# Altium schematic sheet USB_Block.SchDoc
size A4; CheckedBy: CT-Energys; Author: CT-Energys; CompanyName: HTD COMPANY LIMITED; DrawnBy: CHITOAN; Engineer: CHITOAN; Organization: Altium Limited; Address1: HO CHI MINH CITY; Address2: VIETNAM
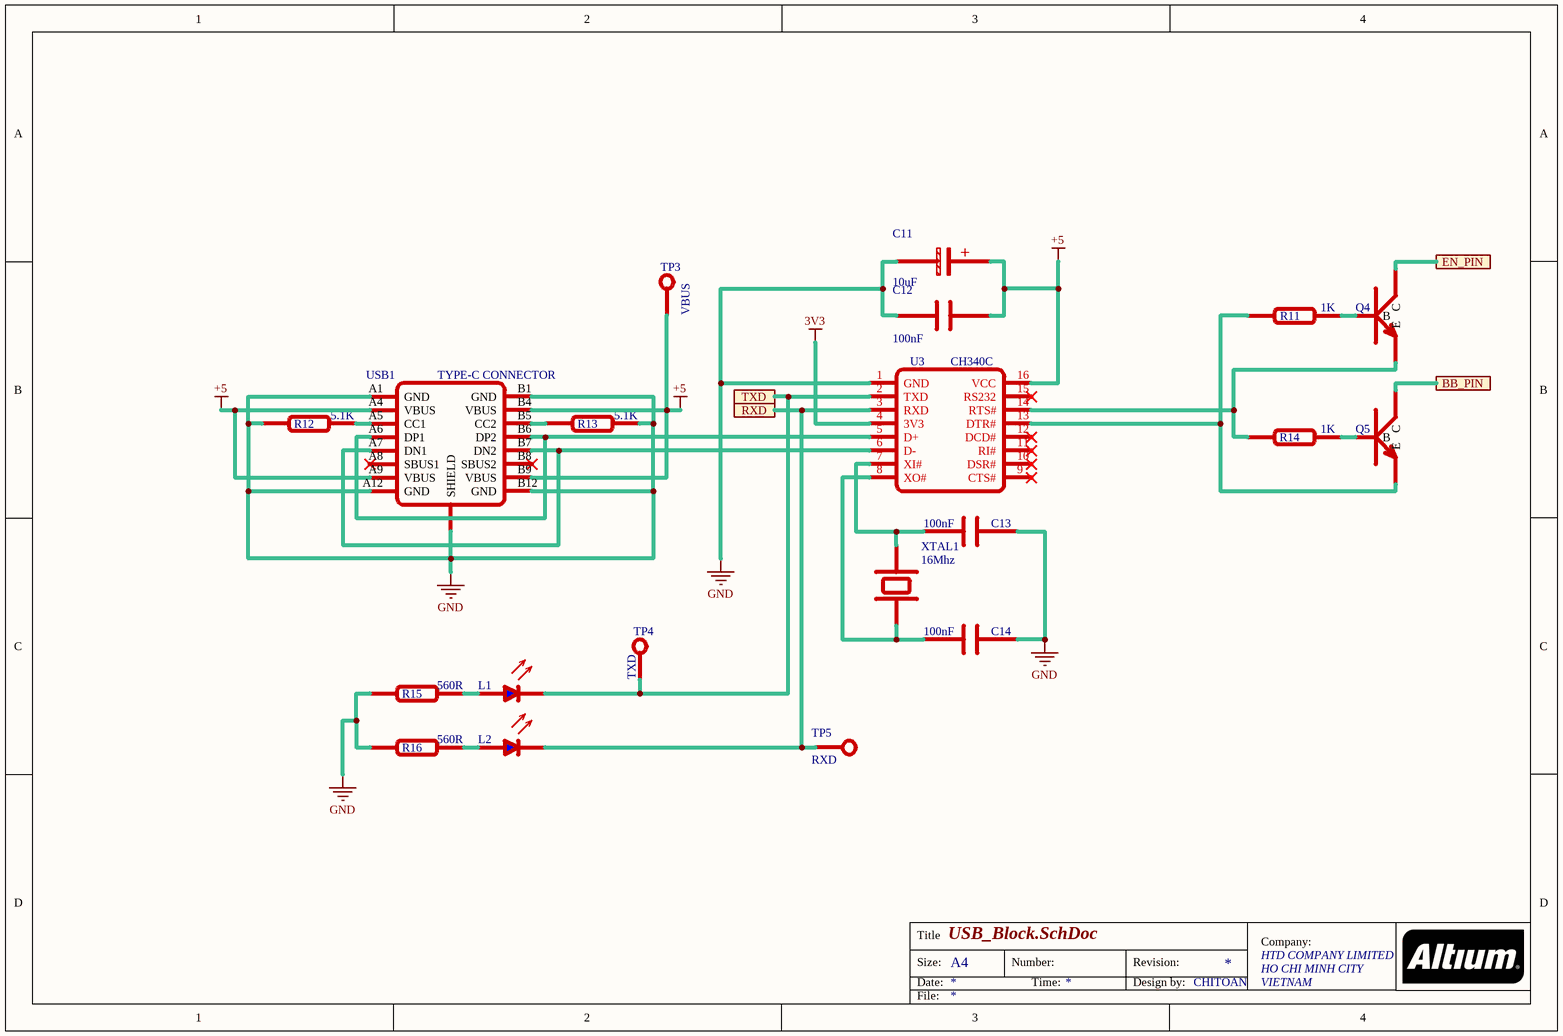
[diagram p0: USB_Block.SchDoc]

## Parts
C11  10uF  [CAP-AL-4x5.4]
C12  100nF  [C0805]
C13  100nF  [C0805]
C14  100nF  [C0805]
L1  LED-BLUE  [LED-0603-BLUE]  (value not drawn)
L2  LED-BLUE  [LED-0603-BLUE]  (value not drawn)
Q4  S8050  [SOT-23]  (value not drawn)
Q5  S8050  [SOT-23]  (value not drawn)
R11  1K  [R0603]
R12  5.1K  [R0603]
R13  5.1K  [R0603]
R14  1K  [R0603]
R15  560R  [R0603]
R16  560R  [R0603]
TP3  VBUS  [Test Point]
TP4  TXD  [Test Point]
TP5  RXD  [Test Point]
U3  CH340C  [SOP-16]
USB1  TYPE-C CONNECTOR  [USB-C-H-K-16P]
XTAL1  16Mhz  [Crystal 5032]

## Ports
BB_PIN, EN_PIN, RXD, TXD

## Nets
3V3: U3.4(3V3)
+5: C11.1 C12.2 TP3.1 U3.16(VCC) USB1.A4(VBUS) USB1.A9(VBUS) USB1.B4(VBUS) USB1.B9(VBUS)
GND: C11.2 C12.1 C13.1 C14.1 R12.2 R13.1 R15.1 R16.1 U3.1(GND) USB1.0(SHIELD) USB1.A1(GND) USB1.A12(GND) USB1.B1(GND) USB1.B12(GND)
BB_PIN: Q5.3(C) ; port BB_PIN
EN_PIN: Q4.3(C) ; port EN_PIN
RXD: L2.2(K) TP5.1 U3.3(RXD) ; port RXD
TXD: L1.2(K) TP4.1 U3.2(TXD) ; port TXD
NetC13_2: C13.2 U3.7(XI#) XTAL1.1
NetC14_2: C14.2 U3.8(XO#) XTAL1.3
NetL1_1: L1.1(A) R15.2
NetL2_1: L2.1(A) R16.2
NetQ4_1: Q4.1(B) R11.2
NetQ4_2: Q4.2(E) R14.1 U3.14(RTS#)
NetQ5_1: Q5.1(B) R14.2
NetQ5_2: Q5.2(E) R11.1 U3.13(DTR#)
NetR12_1: R12.1 USB1.A5(CC1)
NetR13_2: R13.2 USB1.B5(CC2)
NetU3_5: U3.5(D+) USB1.A6(DP1) USB1.B6(DP2)
NetU3_6: U3.6(D-) USB1.A7(DN1) USB1.B7(DN2)

Not connected (* = marked no-connect by the designer): U3 9(CTS#)* 10(DSR#)* 11(RI#)* 12(DCD#)* 15(RS232)*; USB1 A8(SBUS1)* B8(SBUS2)*; XTAL1 2 4

## Notes on the sheet
- Title
- Size:
- Date:
- A4
- Number:
- Time:
- Revision:
- Design by:
- Company:
- File:
- (in symbol CAP-ALU) +

## Library data of the parts
C11 = CAP-ALU: Aluminum Capacitor
C12-C14 = CAP-CER: Ceramic Capacitor
L1 L2 = LED-Blue: Blue Light Emiter Diode
Q4 Q5 = S8050: NPN Transistors 0.5A Collector to Emitter 25V
R11-R16 = Resistor
TP3-TP5 = TestPoint: Test Point
U3 = CH340-16P: USB to UART bridge / CH340-G-C-B; ComponentLink1Description: CH340 Series; ComponentLink1URL: https://cdn.sparkfun.com/datasheets/Dev/Arduino/Other/CH340DS1.PDF
USB1 = USB-C-F-16P: 16P USB TYPE-C CONNECTOR
XTAL1 = CRYSTAL-4P: Crystall 3Pin Capacitor Intergrated